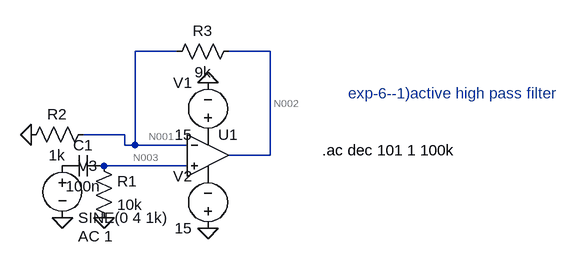
[diagram p0: schematic active high pass filter.asc]
active high pass filter.asc, the LTspice schematic file:
Version 4
SHEET 1 880 680
WIRE 192 48 128 48
WIRE 336 48 272 48
WIRE 112 176 48 176
WIRE 112 192 112 176
WIRE 128 192 128 48
WIRE 128 192 112 192
WIRE 208 192 128 192
WIRE 336 208 336 48
WIRE 336 208 272 208
WIRE 208 224 80 224
FLAG 240 320 0
FLAG 240 96 0
FLAG -32 176 0
FLAG 80 304 0
FLAG 16 304 0
SYMBOL Opamps\\UniversalOpamp2 240 208 R0
SYMATTR InstName U1
SYMBOL voltage 240 192 R180
WINDOW 0 24 96 Left 2
WINDOW 3 24 16 Left 2
WINDOW 123 0 0 Left 0
WINDOW 39 0 0 Left 0
SYMATTR InstName V1
SYMATTR Value 15
SYMBOL voltage 240 336 R180
WINDOW 0 24 96 Left 2
WINDOW 3 24 16 Left 2
WINDOW 123 0 0 Left 0
WINDOW 39 0 0 Left 0
SYMATTR InstName V2
SYMATTR Value 15
SYMBOL res 64 160 R90
WINDOW 0 0 56 VBottom 2
WINDOW 3 32 56 VTop 2
SYMATTR InstName R2
SYMATTR Value 1k
SYMBOL res 288 32 R90
WINDOW 0 0 56 VBottom 2
WINDOW 3 32 56 VTop 2
SYMATTR InstName R3
SYMATTR Value 9k
SYMBOL res 64 208 R0
SYMATTR InstName R1
SYMATTR Value 10k
SYMBOL cap 80 208 R90
WINDOW 0 0 32 VBottom 2
WINDOW 3 32 32 VTop 2
SYMATTR InstName C1
SYMATTR Value 100n
SYMBOL voltage 16 208 R0
WINDOW 123 24 124 Left 2
WINDOW 39 0 0 Left 0
SYMATTR Value2 AC 1
SYMATTR InstName V3
SYMATTR Value SINE(0 4 1k)
TEXT 456 112 Left 2 ;exp-6--1)active high pass filter
TEXT 416 200 Left 2 !.ac dec 101 1 100k

The netlist it stands for:
* active high pass filter.asc
XU1 N003 N001 P001 P002 N002 level.2 Avol=1Meg GBW=10Meg Slew=10Meg ilimit=25m rail=0 Vos=0 phimargin=45 en=0 enk=0 in=0 ink=0 Rin=500Meg  ; pins IN+ IN- V+ V- OUT
V1 P001 0 15
V2 0 P002 15
R2 N001 0 1k
R3 N002 N001 9k
R1 N003 0 10k
C1 N003 P003 100n
V3 P003 0 SINE(0 4 1k) AC 1
* exp-6--1)active high pass filter
.ac dec 101 1 100k
.lib UniversalOpamps2.sub
.backanno
.end

* Results of the author's LTspice run, read from the files saved beside the schematic
* Operating Point, zero values left out:
*   V(p001) = 15 V
*   V(p002) = -15 V
*   I(V2) = -1.498 mA
*   I(V1) = -1.498 mA
*   Ix(u1:3) = 1.498 mA
*   Ix(u1:4) = -1.498 mA
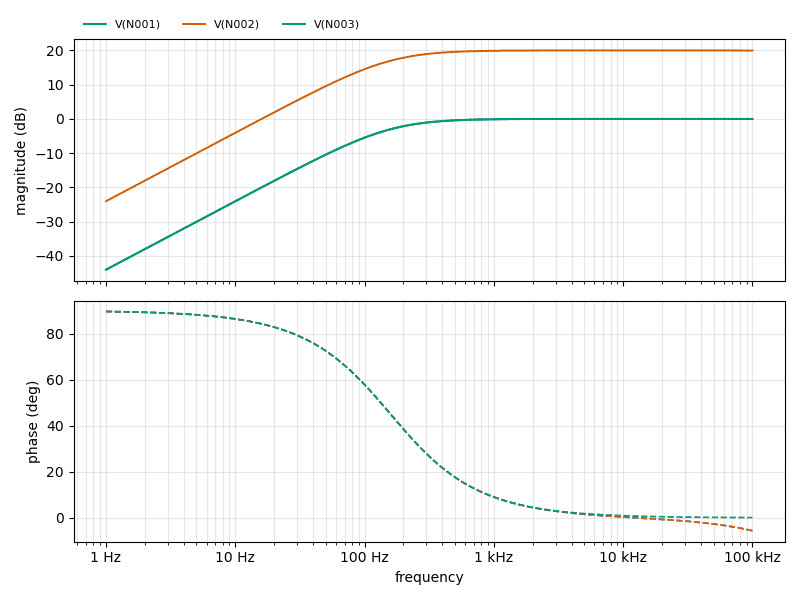
[diagram p1: AC Analysis of active high pass filter.asc, plotted from the saved traces]
* AC Analysis, 1 run:
*   V(N001): -44.04 dB at 1 Hz, -0.04 dB at 100 kHz, peak -0.00 dB at 12.56 kHz, 3 dB below the peak at 159.1 Hz
*   V(N002): -24.04 dB at 1 Hz, 19.96 dB at 100 kHz, peak 20.00 dB at 12.56 kHz, 3 dB below the peak at 159.1 Hz
*   V(N003): -44.04 dB at 1 Hz, -0.00 dB at 100 kHz, peak -0.00 dB at 100 kHz, 3 dB below the peak at 159.2 Hz